# Altium schematic sheet ComparisonSch.SchDoc
size A
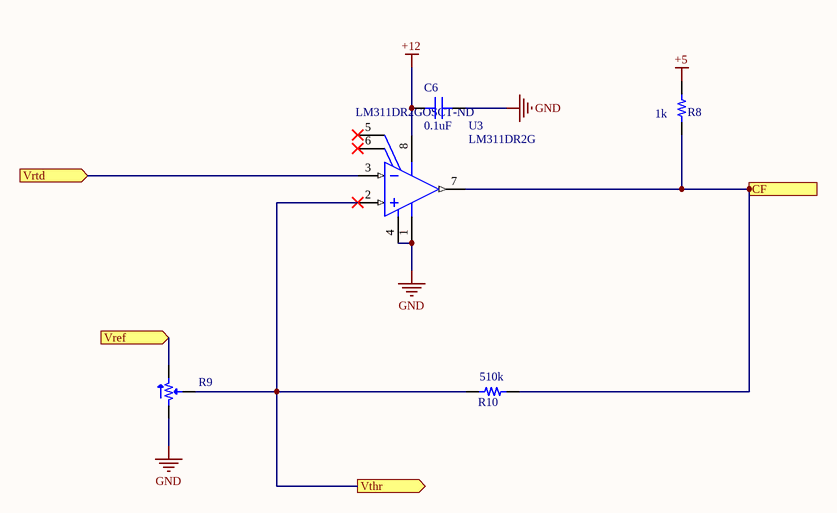
[diagram p0: ComparisonSch.SchDoc]

## Parts
C6  0.1uF  [CAP 0805/2012]
R8  1k  [RES 1206/3216]
R9  20k  [POT MODEL91A]  (value not drawn)
R10  510k  [RES 1206/3216]
U3  LM311DR2G  Supplier Part Number 1: LM311DR2GOSCT-ND  [ONSC-SOIC-8-751-07_V]

## Ports
CF (out), Vref (in), Vrtd (in), Vthr (out)

## Nets
+5: R8.2
+12: C6.1 U3.8(VCC)
GND: C6.2 R9.1 U3.1(GND) U3.4(VEE)
CF: R8.1 R10.2 U3.7(OUT) ; port CF
Vref: R9.3 ; port Vref
Vrtd: U3.3(IN-) ; port Vrtd
Vthr: R9.2 R10.1 U3.2(IN+) ; port Vthr

Not connected (* = marked no-connect by the designer): U3 5(BALANCE)* 6(BALANCE/STROBE)*

## Library data of the parts
C6 = CL21B104KACNNNC: CAP CER 0.1UF 25V X7R 0805; Manufacturer: Samsung Electro-Mechanics America, Inc.; TemperatureRange: -55C ~ 125C; Tolerance: 10%; Value: 0.1uF; Part Number: CL21B104KACNNNC; PartId: 5699; Supplier 1: Digi-Key; Supplier Part Number 1: 1276-1099-2-ND; ComponentLink1Description: Datasheet; ComponentLink1URL: http://www.samsungsem.com/kr/support/product-search/mlcc/CL21B104KACNNNC.jsp; ComponentLink2Description: Digi-Key listing; ComponentLink2URL: http://digikey.com/product-detail/en/CL21B104KACNNNC/1276-1099-2-ND/3886757; TemperatureCoefficient: X7R; Voltage: 25V; Price: 0.0099; Device Package: 0805 (2012 Metric); Type: -
R8 = ERJ-8ENF1001V: RES SMD 1K OHM 1% 1/4W 1206; Manufacturer: Panasonic Electronic Components; TemperatureRange: -55C ~ 155C; TemperatureCoefficient: 100ppm/C; PowerRating: 0.25W, 1/4W; Value: 1k; Part Number: ERJ-8ENF1001V; PartId: 2958; Supplier 1: Digi-Key; Supplier Part Number 1: P1.00KFTR-ND; ComponentLink1Description: Datasheet; ComponentLink1URL: http://industrial.panasonic.com/www-cgi/jvcr13pz.cgi?E+PZ+3+AOA0002+ERJ8ENF1001V+7+WW; ComponentLink2Description: Digi-Key listing; ComponentLink2URL: http://digikey.com/product-detail/en/ERJ-8ENF1001V/P1.00KFTR-ND/86206; Tolerance: 1%; Price: 0.0093; Type: Thick Film; Device Package: 1206 (3216 Metric)
R9 = 91AR20KLF: TRIMMER 20K OHM 3/8" CERMET TH; Manufacturer: TT Electronics/BI; Tolerance: 20%; PowerRating: 0.5W, 1/2W; Number Of Turns: Single; Adjustment Type: Top Adjustment; Value: 20k; Part Number: 91AR20KLF; PartId: 7167; Supplier 1: Digi-Key; Supplier Part Number 1: 987-1170-ND; ComponentLink1Description: Datasheet; ComponentLink1URL: http://www.bitechnologies.com/pdfs/91.pdf; ComponentLink2Description: Digi-Key Listing; ComponentLink2URL: http://www.digikey.ca/product-detail/en/91AR20KLF/987-1170-ND/2408748; Price: 2.25; Type: Through Hole
R10 = ERJ-8GEYJ514V: RES SMD 510K OHM 5% 1/4W 1206; Manufacturer: Panasonic Electronic Components; TemperatureRange: -55C ~ 155C; TemperatureCoefficient: 200ppm/C; PowerRating: 0.25W, 1/4W; Value: 510k; Part Number: ERJ-8GEYJ514V; PartId: 11855; Supplier 1: Digi-Key; Supplier Part Number 1: P510KETR-ND; ComponentLink1Description: Datasheet; ComponentLink1URL: http://industrial.panasonic.com/www-cgi/jvcr13pz.cgi?E+PZ+3+AOA0001+ERJ8GEYJ514V+7+WW; ComponentLink2Description: Digi-Key Listing; ComponentLink2URL: https://www.digikey.com/product-detail/en/panasonic-electronic-components/ERJ-8GEYJ514V/P510KETR-ND/21336; Tolerance: 5%; Price: 0.0045; Device Package: 1206 (3216 Metric)
U3 = CMP-1305-00058-1: Single Comparator, 5 to 30 V, 0 to 70 degC, 8-Pin SOIC, Pb-Free, Tape and Reel; Manufacturer: On Semiconductor; VCC Max (V): 30; VCC Min (V): 5; ICC Typ (mA): 2.4; ComponentLink3Description: Package Specification; ComponentLink1URL: http://www.onsemi.com/; ComponentLink1Description: Manufacturer URL; Mounting Technology: Surface Mount; PackageDescription: 8-Pin Small Outline Integrated Circuit, Body 4.9 x 3.9 mm, Pitch 1.27 mm; ComponentLink2Description: Datasheet; RoHS: TRUE; ComponentLink2URL: http://www.onsemi.com/pub_link/Collateral/LM211-D.PDF; PackageVersion: Rev. AK, 02/2011; PackageReference: SOIC-8-751-07; DatasheetVersion: Rev. 6; Packing: Tape and Reel; ComponentLink3URL: http://www.onsemi.com/pub_link/Collateral/751-07.PDF; PartNumber: LM311DR2G; Supplier 1: Digi-Key